# Altium schematic sheet Sheet1.SchDoc
size A3
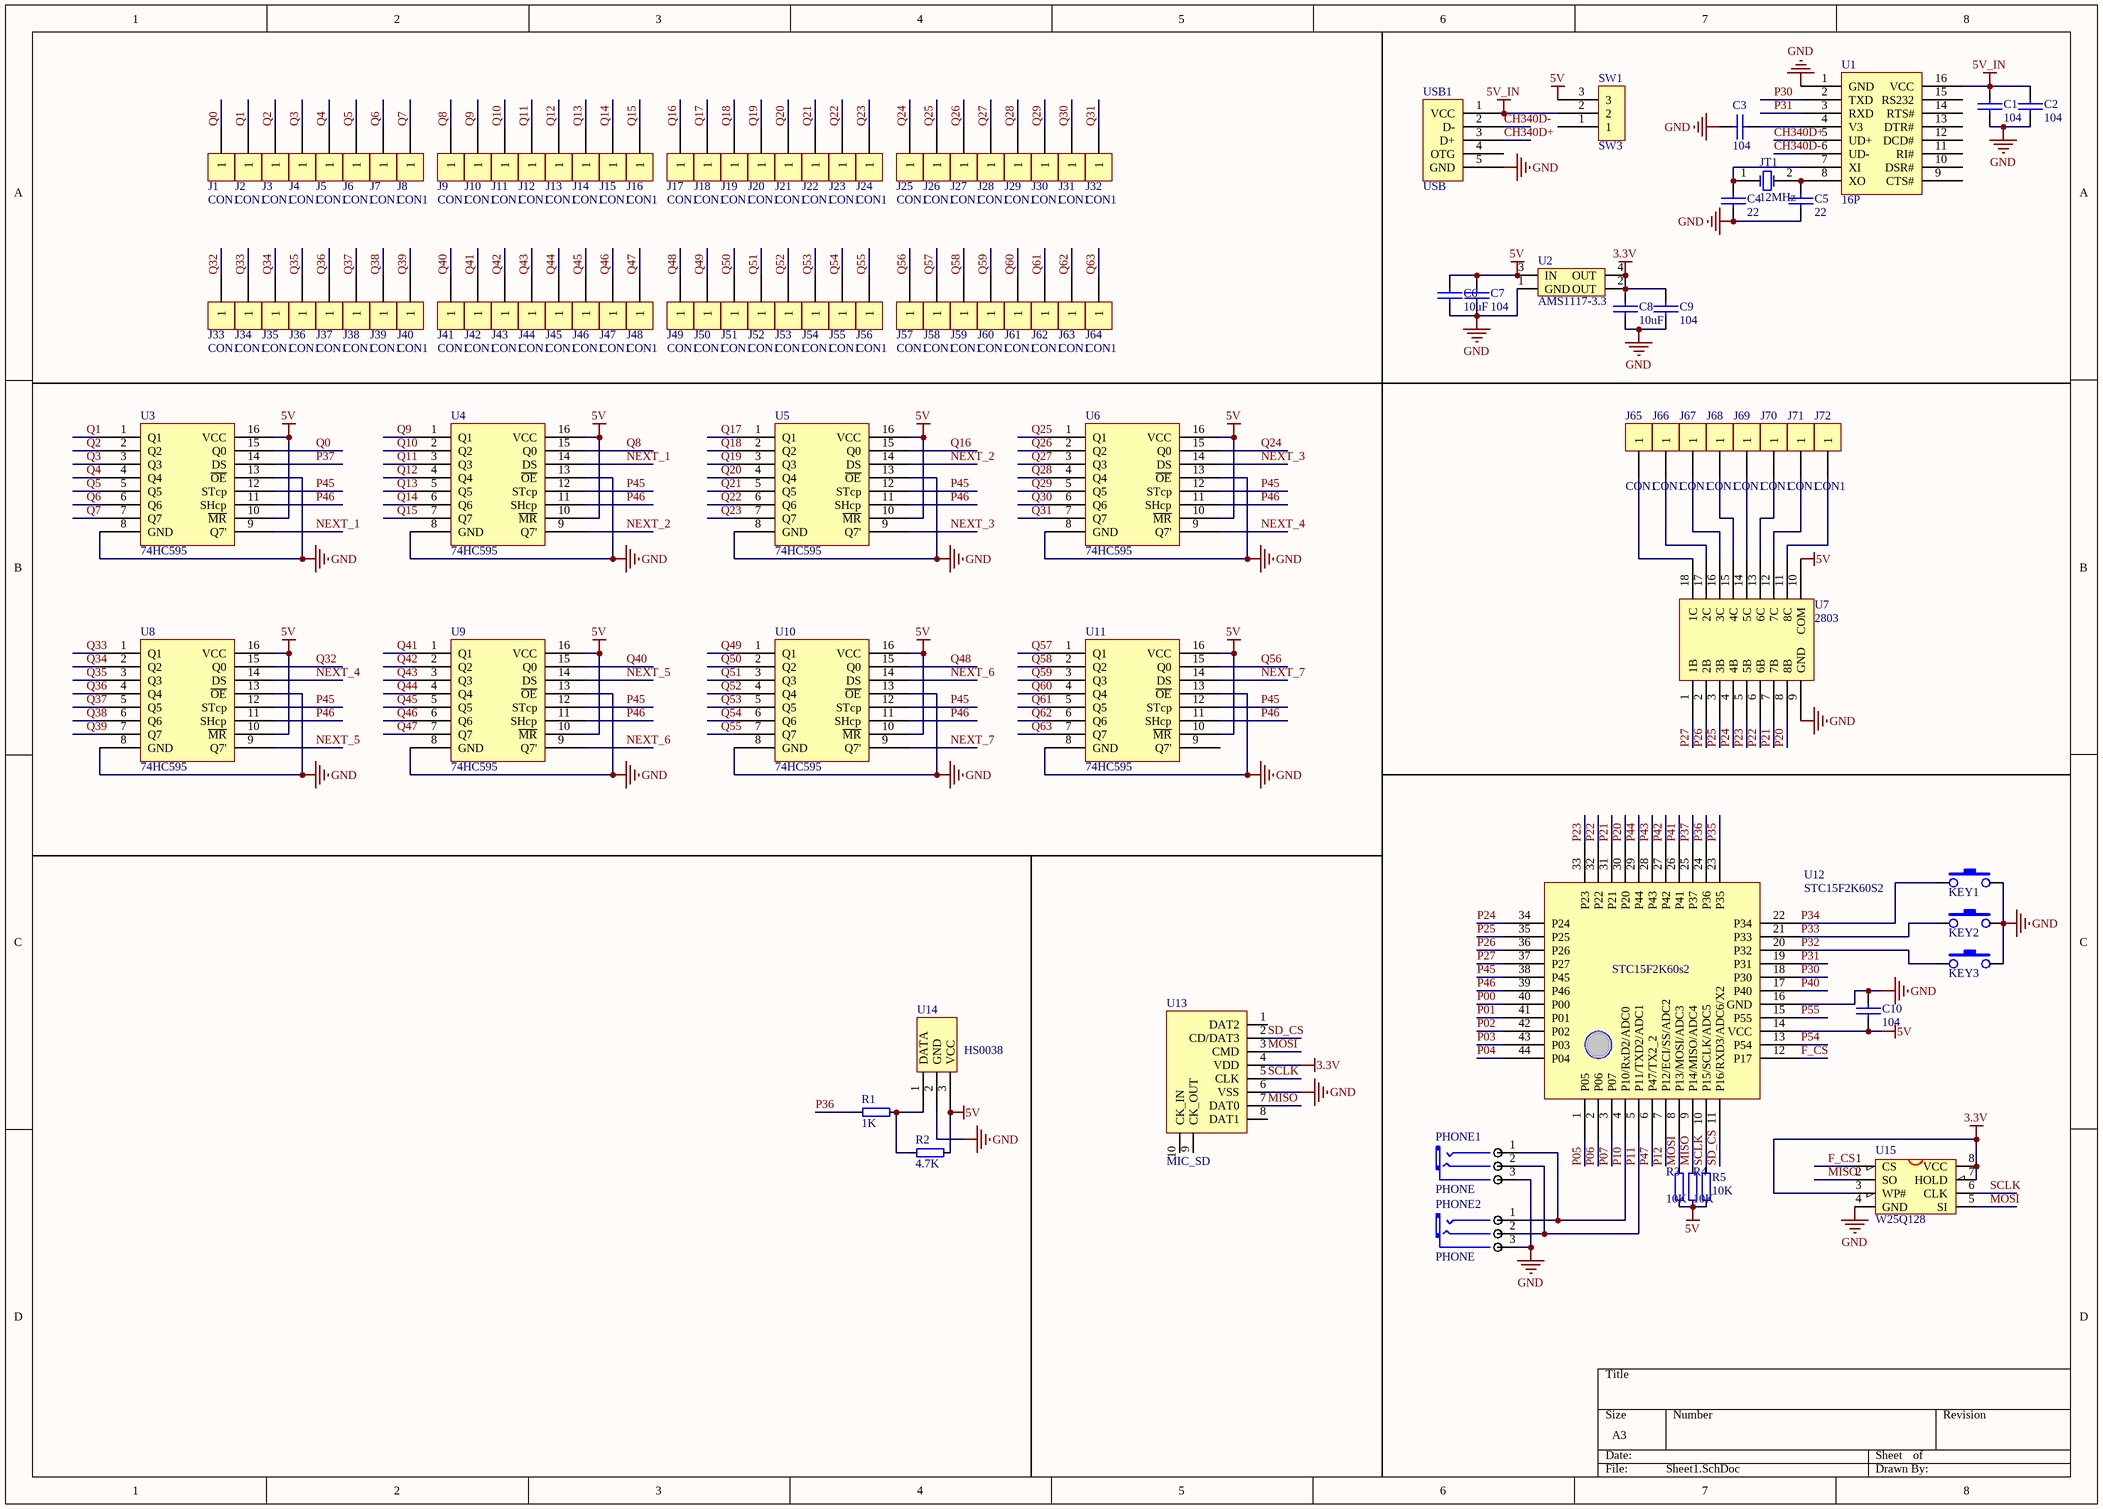
[diagram p0: Sheet1.SchDoc]

## Parts
C1  104  [0805C]
C2  104  [0805C]
C3  104  [0805C]
C4  22  [0805C]
C5  22  [0805C]
C6  10uF  [0805C]
C7  104  [0805C]
C8  10uF  [0805C]
C9  104  [0805C]
C10  104  [0805C]
J1  CON1  [CON1]
J2  CON1  [CON1]
J3  CON1  [CON1]
J4  CON1  [CON1]
J5  CON1  [CON1]
J6  CON1  [CON1]
J7  CON1  [CON1]
J8  CON1  [CON1]
J9  CON1  [CON1]
J10  CON1  [CON1]
J11  CON1  [CON1]
J12  CON1  [CON1]
J13  CON1  [CON1]
J14  CON1  [CON1]
J15  CON1  [CON1]
J16  CON1  [CON1]
J17  CON1  [CON1]
J18  CON1  [CON1]
J19  CON1  [CON1]
J20  CON1  [CON1]
J21  CON1  [CON1]
J22  CON1  [CON1]
J23  CON1  [CON1]
J24  CON1  [CON1]
J25  CON1  [CON1]
J26  CON1  [CON1]
J27  CON1  [CON1]
J28  CON1  [CON1]
J29  CON1  [CON1]
J30  CON1  [CON1]
J31  CON1  [CON1]
J32  CON1  [CON1]
J33  CON1  [CON1]
J34  CON1  [CON1]
J35  CON1  [CON1]
J36  CON1  [CON1]
J37  CON1  [CON1]
J38  CON1  [CON1]
J39  CON1  [CON1]
J40  CON1  [CON1]
J41  CON1  [CON1]
J42  CON1  [CON1]
J43  CON1  [CON1]
J44  CON1  [CON1]
J45  CON1  [CON1]
J46  CON1  [CON1]
J47  CON1  [CON1]
J48  CON1  [CON1]
J49  CON1  [CON1]
J50  CON1  [CON1]
J51  CON1  [CON1]
J52  CON1  [CON1]
J53  CON1  [CON1]
J54  CON1  [CON1]
J55  CON1  [CON1]
J56  CON1  [CON1]
J57  CON1  [CON1]
J58  CON1  [CON1]
J59  CON1  [CON1]
J60  CON1  [CON1]
J61  CON1  [CON1]
J62  CON1  [CON1]
J63  CON1  [CON1]
J64  CON1  [CON1]
J65  CON1  [CON1]
J66  CON1  [CON1]
J67  CON1  [CON1]
J68  CON1  [CON1]
J69  CON1  [CON1]
J70  CON1  [CON1]
J71  CON1  [CON1]
J72  CON1  [CON1]
JT1  12MHz  [JZ]
KEY1  KEY  [KEY2]  (value not drawn)
KEY2  KEY  [KEY2]  (value not drawn)
KEY3  KEY  [KEY2]  (value not drawn)
PHONE1  PHONE  [PHONE_ST]
PHONE2  PHONE  [PHONE_ST]
R1  1K  [0805R]
R2  4.7K  [0805R]
R3  10K  [0805R]
R4  10K  [0805R]
R5  10K  [0805R]
SW1  SW3  [SW3]
U1  16P  [CH340G]
U2  AMS1117-3.3  [AMS1117]
U3  74HC595  [SO-16N]
U4  74HC595  [SO-16N]
U5  74HC595  [SO-16N]
U6  74HC595  [SO-16N]
U7  2803  [SOP-18]
U8  74HC595  [SO-16N]
U9  74HC595  [SO-16N]
U10  74HC595  [SO-16N]
U11  74HC595  [SO-16N]
U12  STC15F2K60S2  [STC15F2K60S2]
U13  MIC_SD  [TF_CARD]
U14  HS0038  [HS0038]
U15  W25Q128  [SOIC-8]
USB1  USB  [MINIUSB]

## Nets
3.3V: C8.1 C9.1 U2.2(OUT) U2.4(OUT) U13.4(VDD) U15.3(WP#) U15.7(HOLD) U15.8(VCC)
5V: C6.1 C7.1 C10.2 R2.1 R3.1 R4.1 R5.1 SW1.3 U2.3(IN) U3.10(~{MR}) U3.16(VCC) U4.10(~{MR}) U4.16(VCC) U5.10(~{MR}) U5.16(VCC) U6.10(~{MR}) U6.16(VCC) U7.10(COM) U8.10(~{MR}) U8.16(VCC) U9.10(~{MR}) U9.16(VCC) U10.10(~{MR}) U10.16(VCC) U11.10(~{MR}) U11.16(VCC) U12.14(VCC) U14.3(VCC)
5V_IN: C1.1 C2.1 SW1.2 U1.16(VCC) USB1.1(VCC)
GND: C1.2 C2.2 C3.1 C4.2 C5.2 C6.2 C7.2 C8.2 C9.2 C10.1 KEY1.2 KEY2.2 KEY3.2 PHONE1.3(COM) PHONE2.3(COM) U1.1(GND) U2.1(GND) U3.8(GND) U3.13(~{OE}) U4.8(GND) U4.13(~{OE}) U5.8(GND) U5.13(~{OE}) U6.8(GND) U6.13(~{OE}) U7.9(GND) U8.8(GND) U8.13(~{OE}) U9.8(GND) U9.13(~{OE}) U10.8(GND) U10.13(~{OE}) U11.8(GND) U11.13(~{OE}) U12.16(GND) U13.6(VSS) U14.2(GND) U15.4(GND) USB1.5(GND)
CH340D+: U1.5(UD+) USB1.3(D+)
CH340D-: U1.6(UD-) USB1.2(D-)
F_CS: U12.12(P17) U15.1(CS)
MISO: R4.2 U12.9(P14/MISO/ADC4) U13.7(DAT0) U15.2(SO)
MOSI: R3.2 U12.8(P13/MOSI/ADC3) U13.3(CMD) U15.5(SI)
NEXT_1: U3.9(Q7') U4.14(DS)
NEXT_2: U4.9(Q7') U5.14(DS)
NEXT_3: U5.9(Q7') U6.14(DS)
NEXT_4: U6.9(Q7') U8.14(DS)
NEXT_5: U8.9(Q7') U9.14(DS)
NEXT_6: U9.9(Q7') U10.14(DS)
NEXT_7: U10.9(Q7') U11.14(DS)
P00: U12.40(P00)
P01: U12.41(P01)
P02: U12.42(P02)
P03: U12.43(P03)
P04: U12.44(P04)
P05: U12.1(P05)
P06: U12.2(P06)
P07: U12.3(P07)
P10: PHONE1.1(CHL) PHONE2.1(CHL) U12.4(P10/RxD2/ADC0)
P11: PHONE1.2(CHR) PHONE2.2(CHR) U12.5(P11/TXD2/ADC1)
P12: U12.7(P12/ECI/SS/ADC2)
P20: U7.8(8B) U12.30(P20)
P21: U7.7(7B) U12.31(P21)
P22: U7.6(6B) U12.32(P22)
P23: U7.5(5B) U12.33(P23)
P24: U7.4(4B) U12.34(P24)
P25: U7.3(3B) U12.35(P25)
P26: U7.2(2B) U12.36(P26)
P27: U7.1(1B) U12.37(P27)
P30: U1.2(TXD) U12.18(P30)
P31: U1.3(RXD) U12.19(P31)
P32: KEY3.1 U12.20(P32)
P33: KEY2.1 U12.21(P33)
P34: KEY1.1 U12.22(P34)
P35: U12.23(P35)
P36: R1.2 U12.24(P36)
P37: U3.14(DS) U12.25(P37)
P40: U12.17(P40)
P41: U12.26(P41)
P42: U12.27(P42)
P43: U12.28(P43)
P44: U12.29(P44)
P45: U3.12(STcp) U4.12(STcp) U5.12(STcp) U6.12(STcp) U8.12(STcp) U9.12(STcp) U10.12(STcp) U11.12(STcp) U12.38(P45)
P46: U3.11(SHcp) U4.11(SHcp) U5.11(SHcp) U6.11(SHcp) U8.11(SHcp) U9.11(SHcp) U10.11(SHcp) U11.11(SHcp) U12.39(P46)
P47: U12.6(P47/TX2_2)
P54: U12.13(P54)
P55: U12.15(P55)
Q0: J1.1 U3.15(Q0)
Q1: J2.1 U3.1(Q1)
Q2: J3.1 U3.2(Q2)
Q3: J4.1 U3.3(Q3)
Q4: J5.1 U3.4(Q4)
Q5: J6.1 U3.5(Q5)
Q6: J7.1 U3.6(Q6)
Q7: J8.1 U3.7(Q7)
Q8: J9.1 U4.15(Q0)
Q9: J10.1 U4.1(Q1)
Q10: J11.1 U4.2(Q2)
Q11: J12.1 U4.3(Q3)
Q12: J13.1 U4.4(Q4)
Q13: J14.1 U4.5(Q5)
Q14: J15.1 U4.6(Q6)
Q15: J16.1 U4.7(Q7)
Q16: J17.1 U5.15(Q0)
Q17: J18.1 U5.1(Q1)
Q18: J19.1 U5.2(Q2)
Q19: J20.1 U5.3(Q3)
Q20: J21.1 U5.4(Q4)
Q21: J22.1 U5.5(Q5)
Q22: J23.1 U5.6(Q6)
Q23: J24.1 U5.7(Q7)
Q24: J25.1 U6.15(Q0)
Q25: J26.1 U6.1(Q1)
Q26: J27.1 U6.2(Q2)
Q27: J28.1 U6.3(Q3)
Q28: J29.1 U6.4(Q4)
Q29: J30.1 U6.5(Q5)
Q30: J31.1 U6.6(Q6)
Q31: J32.1 U6.7(Q7)
Q32: J33.1 U8.15(Q0)
Q33: J34.1 U8.1(Q1)
Q34: J35.1 U8.2(Q2)
Q35: J36.1 U8.3(Q3)
Q36: J37.1 U8.4(Q4)
Q37: J38.1 U8.5(Q5)
Q38: J39.1 U8.6(Q6)
Q39: J40.1 U8.7(Q7)
Q40: J41.1 U9.15(Q0)
Q41: J42.1 U9.1(Q1)
Q42: J43.1 U9.2(Q2)
Q43: J44.1 U9.3(Q3)
Q44: J45.1 U9.4(Q4)
Q45: J46.1 U9.5(Q5)
Q46: J47.1 U9.6(Q6)
Q47: J48.1 U9.7(Q7)
Q48: J49.1 U10.15(Q0)
Q49: J50.1 U10.1(Q1)
Q50: J51.1 U10.2(Q2)
Q51: J52.1 U10.3(Q3)
Q52: J53.1 U10.4(Q4)
Q53: J54.1 U10.5(Q5)
Q54: J55.1 U10.6(Q6)
Q55: J56.1 U10.7(Q7)
Q56: J57.1 U11.15(Q0)
Q57: J58.1 U11.1(Q1)
Q58: J59.1 U11.2(Q2)
Q59: J60.1 U11.3(Q3)
Q60: J61.1 U11.4(Q4)
Q61: J62.1 U11.5(Q5)
Q62: J63.1 U11.6(Q6)
Q63: J64.1 U11.7(Q7)
SCLK: R5.2 U12.10(P15/SCLK/ADC5) U13.5(CLK) U15.6(CLK)
SD_CS: U12.11(P16/RXD3/ADC6/X2) U13.2(CD/DAT3)
NetC3_2: C3.2 U1.4(V3)
NetC4_1: C4.1 JT1.1(OSC1) U1.7(XI)
NetC5_1: C5.1 JT1.2(OSC2) U1.8(XO)
NetJ65_1: J65.1 U7.18(1C)
NetJ66_1: J66.1 U7.17(2C)
NetJ67_1: J67.1 U7.16(3C)
NetJ68_1: J68.1 U7.15(4C)
NetJ69_1: J69.1 U7.14(5C)
NetJ70_1: J70.1 U7.13(6C)
NetJ71_1: J71.1 U7.12(7C)
NetJ72_1: J72.1 U7.11(8C)
NetR1_1: R1.1 R2.2 U14.1(DATA)

Not connected (* = marked no-connect by the designer): SW1 1; U1 9(CTS#) 10(DSR#) 11(RI#) 12(DCD#) 13(DTR#) 14(RTS#) 15(RS232); U11 9(Q7'); U13 1(DAT2) 8(DAT1) 9(CK_OUT) 10(CK_IN); USB1 4(OTG)

## Notes on the sheet
- (in symbol STC15F2K60S2) STC15F2K60s2

## Library data of the parts
C1-C10 = CAP
J1-J72 = CON1: Connector
JT1 = XTAL: Crystal Oscillator; Published: 8-Jun-2000; LatestRevisionDate: 17-Jul-2002; LatestRevisionNote: Re-released for DXP Platform.; Publisher: Altium Limited
PHONE1 PHONE2 = PHONE_M
R1-R5 = RES
U1 = CH340G
U2 = AMS1117
U13 = MICSD
U15 = W25X16: W25X16;SST25VF016;MX25L1605
USB1 = MINIUSB